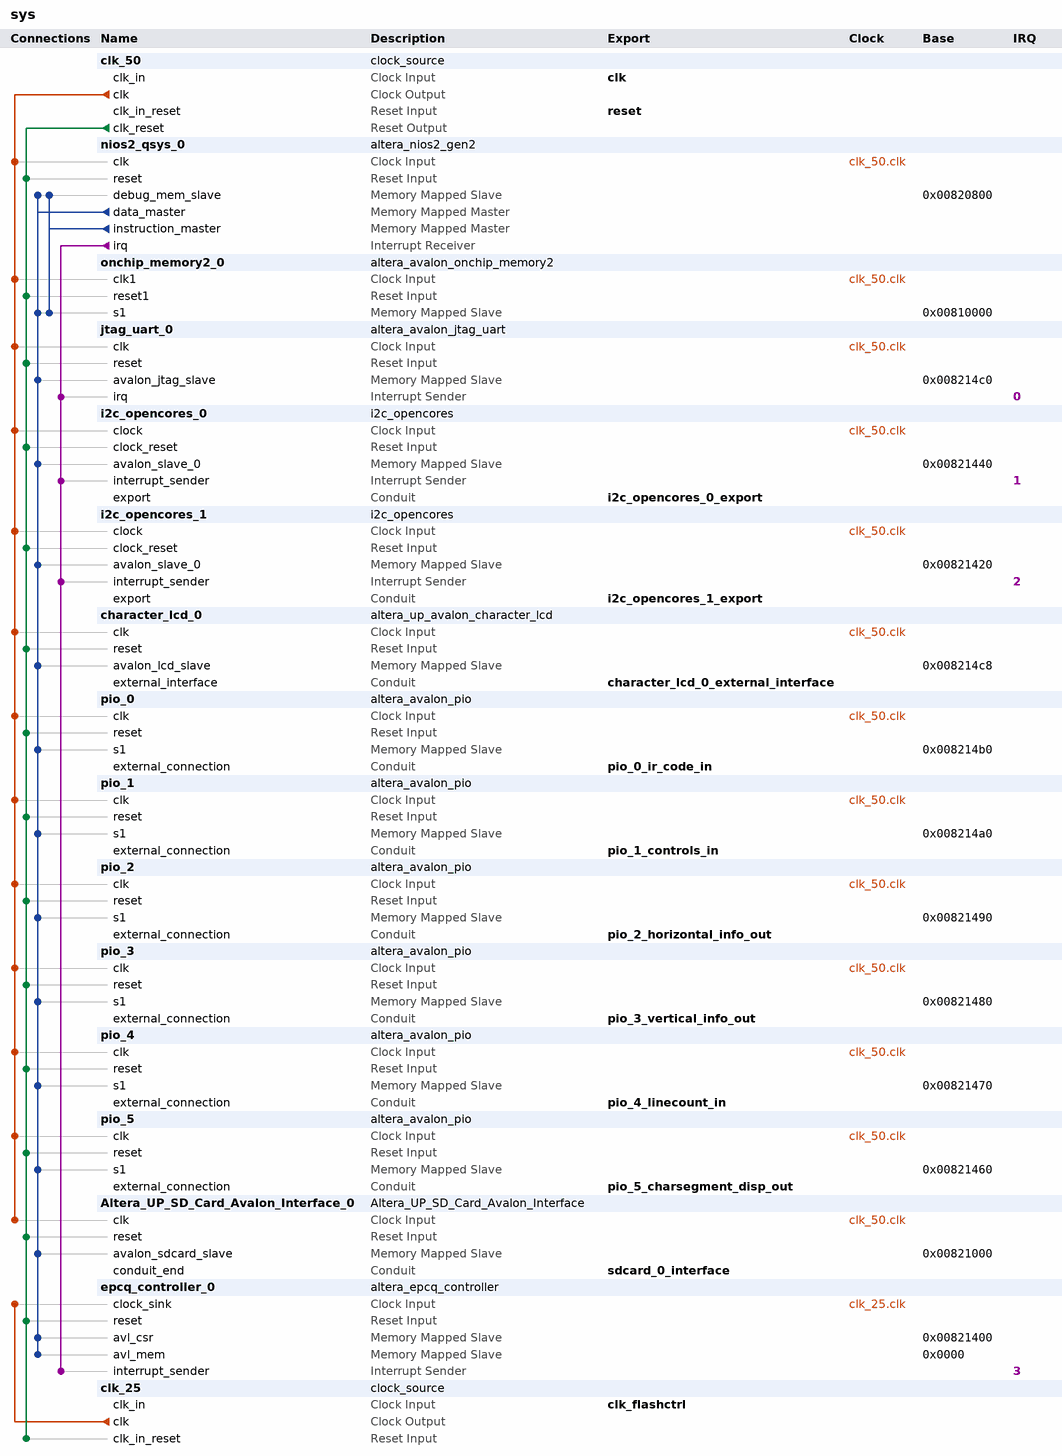
[diagram p0: system contents]
# Platform Designer (Qsys) system sys, Cyclone IV E EP4CE115F29C7
# Parameters at their usual value, and those the tool derives, are not listed.
package require -exact qsys 15.0
create_system sys
set_project_property DEVICE_FAMILY {Cyclone IV E}
set_project_property DEVICE EP4CE115F29C7

add_instance clk_50 clock_source 15.0
set_instance_parameter_value clk_50 clockFrequency 50000000

add_instance nios2_qsys_0 altera_nios2_gen2 15.0
set_instance_parameter_value nios2_qsys_0 dcache_size 0
set_instance_parameter_value nios2_qsys_0 exceptionSlave onchip_memory2_0.s1
set_instance_parameter_value nios2_qsys_0 icache_size 0
set_instance_parameter_value nios2_qsys_0 impl Tiny
set_instance_parameter_value nios2_qsys_0 resetSlave onchip_memory2_0.s1
set_instance_parameter_value nios2_qsys_0 setting_activateTrace true

add_instance onchip_memory2_0 altera_avalon_onchip_memory2 15.0
set_instance_parameter_value onchip_memory2_0 dataWidth 32
set_instance_parameter_value onchip_memory2_0 dualPort false
set_instance_parameter_value onchip_memory2_0 initMemContent true
set_instance_parameter_value onchip_memory2_0 initializationFileName onchip_mem.hex
set_instance_parameter_value onchip_memory2_0 memorySize 65536

add_instance jtag_uart_0 altera_avalon_jtag_uart 15.0
set_instance_parameter_value jtag_uart_0 simInteractiveOptions NO_INTERACTIVE_WINDOWS

add_instance i2c_opencores_0 i2c_opencores 13.0

add_instance i2c_opencores_1 i2c_opencores 13.0

add_instance character_lcd_0 altera_up_avalon_character_lcd 15.0
set_instance_parameter_value character_lcd_0 cursor Normal

add_instance pio_0 altera_avalon_pio 15.0
set_instance_parameter_value pio_0 direction Input
set_instance_parameter_value pio_0 width 32

add_instance pio_1 altera_avalon_pio 15.0
set_instance_parameter_value pio_1 direction Input
set_instance_parameter_value pio_1 width 32

add_instance pio_2 altera_avalon_pio 15.0
set_instance_parameter_value pio_2 direction Output
set_instance_parameter_value pio_2 width 32

add_instance pio_3 altera_avalon_pio 15.0
set_instance_parameter_value pio_3 direction Output
set_instance_parameter_value pio_3 width 32

add_instance pio_4 altera_avalon_pio 15.0
set_instance_parameter_value pio_4 direction Input
set_instance_parameter_value pio_4 width 32

add_instance pio_5 altera_avalon_pio 15.0
set_instance_parameter_value pio_5 direction Output
set_instance_parameter_value pio_5 width 32

add_instance Altera_UP_SD_Card_Avalon_Interface_0 Altera_UP_SD_Card_Avalon_Interface 15.0

add_instance epcq_controller_0 altera_epcq_controller 15.0
set_instance_parameter_value epcq_controller_0 CHIP_SELS 1
set_instance_parameter_value epcq_controller_0 DDASI 0
set_instance_parameter_value epcq_controller_0 FLASH_TYPE EPCS64
set_instance_parameter_value epcq_controller_0 IO_MODE STANDARD

add_instance clk_25 clock_source 15.0
set_instance_parameter_value clk_25 clockFrequency 25000000

# connections
add_connection clk_25.clk epcq_controller_0.clock_sink clock
add_connection clk_50.clk Altera_UP_SD_Card_Avalon_Interface_0.clk clock
add_connection clk_50.clk character_lcd_0.clk clock
add_connection clk_50.clk i2c_opencores_0.clock clock
add_connection clk_50.clk i2c_opencores_1.clock clock
add_connection clk_50.clk jtag_uart_0.clk clock
add_connection clk_50.clk nios2_qsys_0.clk clock
add_connection clk_50.clk onchip_memory2_0.clk1 clock
add_connection clk_50.clk pio_0.clk clock
add_connection clk_50.clk pio_1.clk clock
add_connection clk_50.clk pio_2.clk clock
add_connection clk_50.clk pio_3.clk clock
add_connection clk_50.clk pio_4.clk clock
add_connection clk_50.clk pio_5.clk clock
add_connection clk_50.clk_reset Altera_UP_SD_Card_Avalon_Interface_0.reset reset
add_connection clk_50.clk_reset character_lcd_0.reset reset
add_connection clk_50.clk_reset clk_25.clk_in_reset reset
add_connection clk_50.clk_reset epcq_controller_0.reset reset
add_connection clk_50.clk_reset i2c_opencores_0.clock_reset reset
add_connection clk_50.clk_reset i2c_opencores_1.clock_reset reset
add_connection clk_50.clk_reset jtag_uart_0.reset reset
add_connection clk_50.clk_reset nios2_qsys_0.reset reset
add_connection clk_50.clk_reset onchip_memory2_0.reset1 reset
add_connection clk_50.clk_reset pio_0.reset reset
add_connection clk_50.clk_reset pio_1.reset reset
add_connection clk_50.clk_reset pio_2.reset reset
add_connection clk_50.clk_reset pio_3.reset reset
add_connection clk_50.clk_reset pio_4.reset reset
add_connection clk_50.clk_reset pio_5.reset reset
add_connection nios2_qsys_0.data_master Altera_UP_SD_Card_Avalon_Interface_0.avalon_sdcard_slave avalon
set_connection_parameter_value nios2_qsys_0.data_master/Altera_UP_SD_Card_Avalon_Interface_0.avalon_sdcard_slave baseAddress 0x00821000
add_connection nios2_qsys_0.data_master character_lcd_0.avalon_lcd_slave avalon
set_connection_parameter_value nios2_qsys_0.data_master/character_lcd_0.avalon_lcd_slave baseAddress 0x008214c8
add_connection nios2_qsys_0.data_master epcq_controller_0.avl_csr avalon
set_connection_parameter_value nios2_qsys_0.data_master/epcq_controller_0.avl_csr baseAddress 0x00821400
add_connection nios2_qsys_0.data_master epcq_controller_0.avl_mem avalon
set_connection_parameter_value nios2_qsys_0.data_master/epcq_controller_0.avl_mem baseAddress 0x0000
add_connection nios2_qsys_0.data_master i2c_opencores_0.avalon_slave_0 avalon
set_connection_parameter_value nios2_qsys_0.data_master/i2c_opencores_0.avalon_slave_0 baseAddress 0x00821440
add_connection nios2_qsys_0.data_master i2c_opencores_1.avalon_slave_0 avalon
set_connection_parameter_value nios2_qsys_0.data_master/i2c_opencores_1.avalon_slave_0 baseAddress 0x00821420
add_connection nios2_qsys_0.data_master jtag_uart_0.avalon_jtag_slave avalon
set_connection_parameter_value nios2_qsys_0.data_master/jtag_uart_0.avalon_jtag_slave baseAddress 0x008214c0
add_connection nios2_qsys_0.data_master nios2_qsys_0.debug_mem_slave avalon
set_connection_parameter_value nios2_qsys_0.data_master/nios2_qsys_0.debug_mem_slave baseAddress 0x00820800
add_connection nios2_qsys_0.data_master onchip_memory2_0.s1 avalon
set_connection_parameter_value nios2_qsys_0.data_master/onchip_memory2_0.s1 baseAddress 0x00810000
add_connection nios2_qsys_0.data_master pio_0.s1 avalon
set_connection_parameter_value nios2_qsys_0.data_master/pio_0.s1 baseAddress 0x008214b0
add_connection nios2_qsys_0.data_master pio_1.s1 avalon
set_connection_parameter_value nios2_qsys_0.data_master/pio_1.s1 baseAddress 0x008214a0
add_connection nios2_qsys_0.data_master pio_2.s1 avalon
set_connection_parameter_value nios2_qsys_0.data_master/pio_2.s1 baseAddress 0x00821490
add_connection nios2_qsys_0.data_master pio_3.s1 avalon
set_connection_parameter_value nios2_qsys_0.data_master/pio_3.s1 baseAddress 0x00821480
add_connection nios2_qsys_0.data_master pio_4.s1 avalon
set_connection_parameter_value nios2_qsys_0.data_master/pio_4.s1 baseAddress 0x00821470
add_connection nios2_qsys_0.data_master pio_5.s1 avalon
set_connection_parameter_value nios2_qsys_0.data_master/pio_5.s1 baseAddress 0x00821460
add_connection nios2_qsys_0.instruction_master nios2_qsys_0.debug_mem_slave avalon
set_connection_parameter_value nios2_qsys_0.instruction_master/nios2_qsys_0.debug_mem_slave baseAddress 0x00820800
add_connection nios2_qsys_0.instruction_master onchip_memory2_0.s1 avalon
set_connection_parameter_value nios2_qsys_0.instruction_master/onchip_memory2_0.s1 baseAddress 0x00810000
add_connection nios2_qsys_0.irq epcq_controller_0.interrupt_sender interrupt
set_connection_parameter_value nios2_qsys_0.irq/epcq_controller_0.interrupt_sender irqNumber 3
add_connection nios2_qsys_0.irq i2c_opencores_0.interrupt_sender interrupt
set_connection_parameter_value nios2_qsys_0.irq/i2c_opencores_0.interrupt_sender irqNumber 1
add_connection nios2_qsys_0.irq i2c_opencores_1.interrupt_sender interrupt
set_connection_parameter_value nios2_qsys_0.irq/i2c_opencores_1.interrupt_sender irqNumber 2
add_connection nios2_qsys_0.irq jtag_uart_0.irq interrupt
set_connection_parameter_value nios2_qsys_0.irq/jtag_uart_0.irq irqNumber 0

# exported interfaces
add_interface character_lcd_0_external_interface conduit end
set_interface_property character_lcd_0_external_interface EXPORT_OF character_lcd_0.external_interface
add_interface clk clock sink
set_interface_property clk EXPORT_OF clk_50.clk_in
add_interface clk_flashctrl clock sink
set_interface_property clk_flashctrl EXPORT_OF clk_25.clk_in
add_interface i2c_opencores_0_export conduit end
set_interface_property i2c_opencores_0_export EXPORT_OF i2c_opencores_0.export
add_interface i2c_opencores_1_export conduit end
set_interface_property i2c_opencores_1_export EXPORT_OF i2c_opencores_1.export
add_interface pio_0_ir_code_in conduit end
set_interface_property pio_0_ir_code_in EXPORT_OF pio_0.external_connection
add_interface pio_1_controls_in conduit end
set_interface_property pio_1_controls_in EXPORT_OF pio_1.external_connection
add_interface pio_2_horizontal_info_out conduit end
set_interface_property pio_2_horizontal_info_out EXPORT_OF pio_2.external_connection
add_interface pio_3_vertical_info_out conduit end
set_interface_property pio_3_vertical_info_out EXPORT_OF pio_3.external_connection
add_interface pio_4_linecount_in conduit end
set_interface_property pio_4_linecount_in EXPORT_OF pio_4.external_connection
add_interface pio_5_charsegment_disp_out conduit end
set_interface_property pio_5_charsegment_disp_out EXPORT_OF pio_5.external_connection
add_interface reset reset sink
set_interface_property reset EXPORT_OF clk_50.clk_in_reset
add_interface sdcard_0_interface conduit end
set_interface_property sdcard_0_interface EXPORT_OF Altera_UP_SD_Card_Avalon_Interface_0.conduit_end

set_interconnect_requirement {$system} qsys_mm.clockCrossingAdapter HANDSHAKE
set_interconnect_requirement {$system} qsys_mm.insertDefaultSlave false
set_interconnect_requirement {$system} qsys_mm.maxAdditionalLatency 1

save_system sys.qsys
